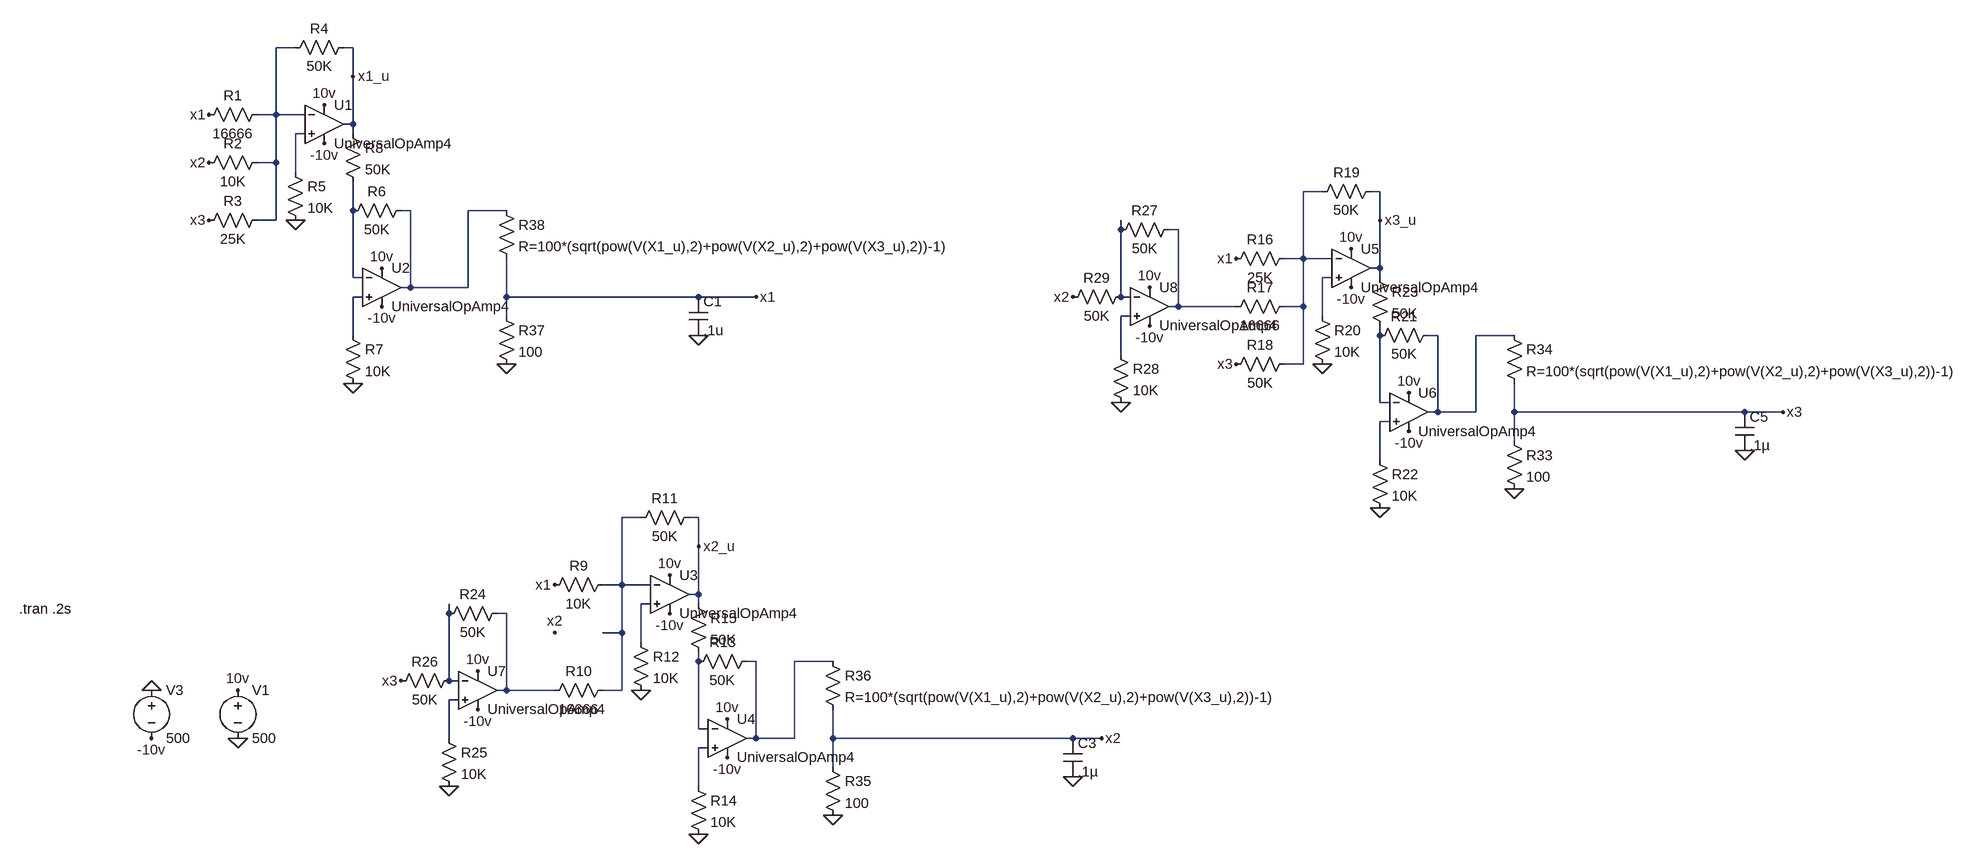
[diagram p0: schematic eigensolver_nonormal.asc]
eigensolver_nonormal.asc, the LTspice schematic file:
Version 4
SHEET 1 4748 2224
WIRE 1712 -240 1680 -240
WIRE 1808 -240 1792 -240
WIRE 1808 -192 1808 -240
WIRE 1680 -128 1680 -240
WIRE 1680 -128 1648 -128
WIRE 1728 -128 1680 -128
WIRE 1808 -112 1808 -192
WIRE 1808 -112 1792 -112
WIRE 1728 -96 1712 -96
WIRE 1808 -96 1808 -112
WIRE 1680 -48 1680 -128
WIRE 1680 -48 1648 -48
WIRE 1712 -32 1712 -96
WIRE 3424 0 3392 0
WIRE 3520 0 3504 0
WIRE 1808 32 1808 -16
WIRE 1904 32 1888 32
WIRE 2064 32 2000 32
WIRE 1680 48 1680 -48
WIRE 1680 48 1648 48
WIRE 3520 48 3520 0
WIRE 3088 64 3088 48
WIRE 3184 64 3168 64
WIRE 3392 112 3392 0
WIRE 3392 112 3360 112
WIRE 3440 112 3392 112
WIRE 3520 128 3520 48
WIRE 3520 128 3504 128
WIRE 1808 144 1808 32
WIRE 1824 144 1808 144
WIRE 3440 144 3424 144
WIRE 3520 144 3520 128
WIRE 1904 160 1904 32
WIRE 1904 160 1888 160
WIRE 2000 160 2000 32
WIRE 2000 160 1904 160
WIRE 1824 176 1808 176
WIRE 2064 176 2064 112
WIRE 2384 176 2064 176
WIRE 2480 176 2384 176
WIRE 3088 176 3088 64
WIRE 3104 176 3088 176
WIRE 3184 192 3184 64
WIRE 3184 192 3168 192
WIRE 3280 192 3184 192
WIRE 3392 192 3392 112
WIRE 3392 192 3360 192
WIRE 2064 208 2064 176
WIRE 3104 208 3088 208
WIRE 3424 208 3424 144
WIRE 1808 240 1808 176
WIRE 3520 240 3520 224
WIRE 3616 240 3600 240
WIRE 3744 240 3680 240
WIRE 3088 272 3088 208
WIRE 3392 288 3392 192
WIRE 3392 288 3360 288
WIRE 3520 352 3520 240
WIRE 3536 352 3520 352
WIRE 3616 368 3616 240
WIRE 3616 368 3600 368
WIRE 3680 368 3680 240
WIRE 3680 368 3616 368
WIRE 3744 368 3744 320
WIRE 4128 368 3744 368
WIRE 4192 368 4128 368
WIRE 3536 384 3520 384
WIRE 3744 416 3744 368
WIRE 3520 448 3520 384
WIRE 2288 544 2256 544
WIRE 2384 544 2368 544
WIRE 2384 592 2384 544
WIRE 2256 656 2256 544
WIRE 2256 656 2224 656
WIRE 2304 656 2256 656
WIRE 2384 672 2384 592
WIRE 2384 672 2368 672
WIRE 2304 688 2288 688
WIRE 2384 688 2384 672
WIRE 1968 704 1968 688
WIRE 2064 704 2048 704
WIRE 2256 736 2256 656
WIRE 2256 736 2224 736
WIRE 2288 752 2288 688
WIRE 2384 784 2384 768
WIRE 2480 784 2464 784
WIRE 2608 784 2544 784
WIRE 1968 816 1968 704
WIRE 1984 816 1968 816
WIRE 2064 832 2064 704
WIRE 2064 832 2048 832
WIRE 2144 832 2064 832
WIRE 2256 832 2256 736
WIRE 2256 832 2224 832
WIRE 1984 848 1968 848
WIRE 2384 896 2384 784
WIRE 2400 896 2384 896
WIRE 1968 912 1968 848
WIRE 2480 912 2480 784
WIRE 2480 912 2464 912
WIRE 2544 912 2544 784
WIRE 2544 912 2480 912
WIRE 2608 912 2608 864
WIRE 3008 912 2608 912
WIRE 3056 912 3008 912
WIRE 2400 928 2384 928
WIRE 2608 960 2608 912
WIRE 2384 992 2384 928
FLAG 1616 832 10v
FLAG 1616 912 0
FLAG 1472 832 0
FLAG 1472 912 -10v
FLAG 1760 -144 10v
FLAG 1568 -48 x2
FLAG 1568 -128 x1
FLAG 1568 48 x3
FLAG 1712 48 0
FLAG 1760 -80 -10v
FLAG 1856 128 10v
FLAG 1808 320 0
FLAG 1856 192 -10v
FLAG 2336 640 10v
FLAG 2288 832 0
FLAG 2336 704 -10v
FLAG 2432 880 10v
FLAG 2384 1072 0
FLAG 2432 944 -10v
FLAG 3472 96 10v
FLAG 3424 288 0
FLAG 3472 160 -10v
FLAG 3568 336 10v
FLAG 3520 528 0
FLAG 3568 400 -10v
FLAG 2144 736 x2
FLAG 2144 656 x1
FLAG 1888 816 x3
FLAG 3280 112 x1
FLAG 3280 288 x3
FLAG 2016 800 10v
FLAG 1968 992 0
FLAG 2016 864 -10v
FLAG 3008 176 x2
FLAG 3136 160 10v
FLAG 3088 352 0
FLAG 3136 224 -10v
FLAG 2480 176 x1
FLAG 3744 496 0
FLAG 4192 368 x3
FLAG 2608 1040 0
FLAG 2064 288 0
FLAG 3056 912 x2
FLAG 1808 -192 x1_u
FLAG 2384 592 x2_u
FLAG 3520 48 x3_u
FLAG 2384 240 0
FLAG 3008 976 0
FLAG 4128 432 0
SYMBOL voltage 1616 816 R0
WINDOW 123 0 0 Left 0
SYMATTR InstName V1
SYMATTR Value 500
SYMATTR SpiceLine Rser=.8
SYMBOL voltage 1472 816 R0
WINDOW 123 0 0 Left 0
SYMATTR InstName V3
SYMATTR Value 500
SYMATTR SpiceLine Rser=.8
SYMBOL OpAmps\\UniversalOpAmp4 1760 -112 R0
SYMATTR InstName U1
SYMBOL res 1664 -144 R90
WINDOW 0 0 56 VBottom 2
WINDOW 3 32 56 VTop 2
SYMATTR InstName R1
SYMATTR Value 16666
SYMBOL res 1664 -64 R90
WINDOW 0 0 56 VBottom 2
WINDOW 3 32 56 VTop 2
SYMATTR InstName R2
SYMATTR Value 10K
SYMBOL res 1664 32 R90
WINDOW 0 0 56 VBottom 2
WINDOW 3 32 56 VTop 2
SYMATTR InstName R3
SYMATTR Value 25K
SYMBOL res 1808 -256 R90
WINDOW 0 0 56 VBottom 2
WINDOW 3 32 56 VTop 2
SYMATTR InstName R4
SYMATTR Value 50K
SYMBOL res 1696 -48 R0
SYMATTR InstName R5
SYMATTR Value 10K
SYMBOL OpAmps\\UniversalOpAmp4 1856 160 R0
SYMATTR InstName U2
SYMBOL res 1904 16 R90
WINDOW 0 0 56 VBottom 2
WINDOW 3 32 56 VTop 2
SYMATTR InstName R6
SYMATTR Value 50K
SYMBOL res 1792 224 R0
SYMATTR InstName R7
SYMATTR Value 10K
SYMBOL res 1792 -112 R0
SYMATTR InstName R8
SYMATTR Value 50K
SYMBOL OpAmps\\UniversalOpAmp4 2336 672 R0
SYMATTR InstName U3
SYMBOL res 2240 640 R90
WINDOW 0 0 56 VBottom 2
WINDOW 3 32 56 VTop 2
SYMATTR InstName R9
SYMATTR Value 10K
SYMBOL res 2240 816 R90
WINDOW 0 0 56 VBottom 2
WINDOW 3 32 56 VTop 2
SYMATTR InstName R10
SYMATTR Value 16666
SYMBOL res 2384 528 R90
WINDOW 0 0 56 VBottom 2
WINDOW 3 32 56 VTop 2
SYMATTR InstName R11
SYMATTR Value 50K
SYMBOL res 2272 736 R0
SYMATTR InstName R12
SYMATTR Value 10K
SYMBOL OpAmps\\UniversalOpAmp4 2432 912 R0
SYMATTR InstName U4
SYMBOL res 2480 768 R90
WINDOW 0 0 56 VBottom 2
WINDOW 3 32 56 VTop 2
SYMATTR InstName R13
SYMATTR Value 50K
SYMBOL res 2368 976 R0
SYMATTR InstName R14
SYMATTR Value 10K
SYMBOL res 2368 672 R0
SYMATTR InstName R15
SYMATTR Value 50K
SYMBOL OpAmps\\UniversalOpAmp4 3472 128 R0
SYMATTR InstName U5
SYMBOL res 3376 96 R90
WINDOW 0 0 56 VBottom 2
WINDOW 3 32 56 VTop 2
SYMATTR InstName R16
SYMATTR Value 25K
SYMBOL res 3376 176 R90
WINDOW 0 0 56 VBottom 2
WINDOW 3 32 56 VTop 2
SYMATTR InstName R17
SYMATTR Value 16666
SYMBOL res 3376 272 R90
WINDOW 0 0 56 VBottom 2
WINDOW 3 32 56 VTop 2
SYMATTR InstName R18
SYMATTR Value 50K
SYMBOL res 3520 -16 R90
WINDOW 0 0 56 VBottom 2
WINDOW 3 32 56 VTop 2
SYMATTR InstName R19
SYMATTR Value 50K
SYMBOL res 3408 192 R0
SYMATTR InstName R20
SYMATTR Value 10K
SYMBOL OpAmps\\UniversalOpAmp4 3568 368 R0
SYMATTR InstName U6
SYMBOL res 3616 224 R90
WINDOW 0 0 56 VBottom 2
WINDOW 3 32 56 VTop 2
SYMATTR InstName R21
SYMATTR Value 50K
SYMBOL res 3504 432 R0
SYMATTR InstName R22
SYMATTR Value 10K
SYMBOL res 3504 128 R0
SYMATTR InstName R23
SYMATTR Value 50K
SYMBOL OpAmps\\UniversalOpAmp4 2016 832 R0
SYMATTR InstName U7
SYMBOL res 2064 688 R90
WINDOW 0 0 56 VBottom 2
WINDOW 3 32 56 VTop 2
SYMATTR InstName R24
SYMATTR Value 50K
SYMBOL res 1952 896 R0
SYMATTR InstName R25
SYMATTR Value 10K
SYMBOL res 1984 800 R90
WINDOW 0 0 56 VBottom 2
WINDOW 3 32 56 VTop 2
SYMATTR InstName R26
SYMATTR Value 50K
SYMBOL OpAmps\\UniversalOpAmp4 3136 192 R0
SYMATTR InstName U8
SYMBOL res 3184 48 R90
WINDOW 0 0 56 VBottom 2
WINDOW 3 32 56 VTop 2
SYMATTR InstName R27
SYMATTR Value 50K
SYMBOL res 3072 256 R0
SYMATTR InstName R28
SYMATTR Value 10K
SYMBOL res 3104 160 R90
WINDOW 0 0 56 VBottom 2
WINDOW 3 32 56 VTop 2
SYMATTR InstName R29
SYMATTR Value 50K
SYMBOL res 3728 400 R0
SYMATTR InstName R33
SYMATTR Value 100
SYMBOL res 3728 224 R0
SYMATTR InstName R34
SYMATTR Value R=100*(sqrt(pow(V(X1_u),2)+pow(V(X2_u),2)+pow(V(X3_u),2))-1)
SYMBOL res 2592 944 R0
SYMATTR InstName R35
SYMATTR Value 100
SYMBOL res 2592 768 R0
SYMATTR InstName R36
SYMATTR Value R=100*(sqrt(pow(V(X1_u),2)+pow(V(X2_u),2)+pow(V(X3_u),2))-1)
SYMBOL res 2048 192 R0
SYMATTR InstName R37
SYMATTR Value 100
SYMBOL res 2048 16 R0
SYMATTR InstName R38
SYMATTR Value R=100*(sqrt(pow(V(X1_u),2)+pow(V(X2_u),2)+pow(V(X3_u),2))-1)
SYMBOL cap 2368 176 R0
SYMATTR InstName C1
SYMATTR Value ,1u
SYMBOL cap 2992 912 R0
SYMATTR InstName C3
SYMATTR Value .1µ
SYMBOL cap 4112 368 R0
SYMATTR InstName C5
SYMATTR Value .1µ
TEXT 688 696 Left 2 !.tran .2s

The netlist it stands for:
* eigensolver_nonormal.asc
V1 10v 0 500 Rser=.8
V3 0 -10v 500 Rser=.8
* U1: UniversalOpAmp4 (symbol OpAmps\UniversalOpAmp4 not available, pins judged from their places): In+=N002 In-=N001 V+=10v V-=-10v OUT=x1_u
R1 N001 x1 16666
R2 N001 x2 10K
R3 N001 x3 25K
R4 x1_u N001 50K
R5 N002 0 10K
* U2: UniversalOpAmp4 (symbol OpAmps\UniversalOpAmp4 not available, pins judged from their places): In+=N009 In-=N004 V+=10v V-=-10v OUT=N005
R6 N005 N004 50K
R7 N009 0 10K
R8 x1_u N004 50K
* U3: UniversalOpAmp4 (symbol OpAmps\UniversalOpAmp4 not available, pins judged from their places): In+=N015 In-=N014 V+=10v V-=-10v OUT=x2_u
R9 N014 x1 10K
R10 N014 N017 16666
R11 x2_u N014 50K
R12 N015 0 10K
* U4: UniversalOpAmp4 (symbol OpAmps\UniversalOpAmp4 not available, pins judged from their places): In+=N021 In-=N018 V+=10v V-=-10v OUT=N019
R13 N019 N018 50K
R14 N021 0 10K
R15 x2_u N018 50K
* U5: UniversalOpAmp4 (symbol OpAmps\UniversalOpAmp4 not available, pins judged from their places): In+=N008 In-=N003 V+=10v V-=-10v OUT=x3_u
R16 N003 x1 25K
R17 N003 N007 16666
R18 N003 x3 50K
R19 x3_u N003 50K
R20 N008 0 10K
* U6: UniversalOpAmp4 (symbol OpAmps\UniversalOpAmp4 not available, pins judged from their places): In+=N013 In-=N011 V+=10v V-=-10v OUT=N012
R21 N012 N011 50K
R22 N013 0 10K
R23 x3_u N011 50K
* U7: UniversalOpAmp4 (symbol OpAmps\UniversalOpAmp4 not available, pins judged from their places): In+=N020 In-=N016 V+=10v V-=-10v OUT=N017
R24 N017 N016 50K
R25 N020 0 10K
R26 N016 x3 50K
* U8: UniversalOpAmp4 (symbol OpAmps\UniversalOpAmp4 not available, pins judged from their places): In+=N010 In-=N006 V+=10v V-=-10v OUT=N007
R27 N007 N006 50K
R28 N010 0 10K
R29 N006 x2 50K
R33 x3 0 100
R34 N012 x3 R=100*(sqrt(pow(V(X1_u),2)+pow(V(X2_u),2)+pow(V(X3_u),2))-1)
R35 x2 0 100
R36 N019 x2 R=100*(sqrt(pow(V(X1_u),2)+pow(V(X2_u),2)+pow(V(X3_u),2))-1)
R37 x1 0 100
R38 N005 x1 R=100*(sqrt(pow(V(X1_u),2)+pow(V(X2_u),2)+pow(V(X3_u),2))-1)
C1 x1 0 ,1u
C3 x2 0 .1µ
C5 x3 0 .1µ
.tran .2s
.backanno
.end